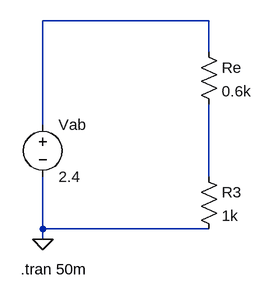
[diagram p0: schematic Draft2.asc]
Draft2.asc, the LTspice schematic file:
Version 4
SHEET 1 880 680
WIRE 368 -32 112 -32
WIRE 368 16 368 -32
WIRE 112 128 112 -32
WIRE 368 208 368 96
WIRE 112 288 112 208
WIRE 368 288 112 288
WIRE 112 304 112 288
FLAG 112 304 0
SYMBOL voltage 112 112 R0
WINDOW 123 0 0 Left 0
WINDOW 39 0 0 Left 0
SYMATTR InstName Vab
SYMATTR Value 2.4
SYMBOL res 352 192 R0
SYMATTR InstName R3
SYMATTR Value 1k
SYMATTR SpiceLine tol=5 pwr=0.1
SYMBOL res 352 0 R0
SYMATTR InstName Re
SYMATTR Value 0.6k
SYMATTR SpiceLine tol=5 pwr=0.1
TEXT 78 350 Left 2 !.tran 50m

The netlist it stands for:
* Draft2.asc
Vab N001 0 2.4
R3 N002 0 1k tol=5 pwr=0.1
Re N001 N002 0.6k tol=5 pwr=0.1
.tran 50m
.backanno
.end